# EAGLE design MultifyMainDriver (EAGLE 7.0.0)
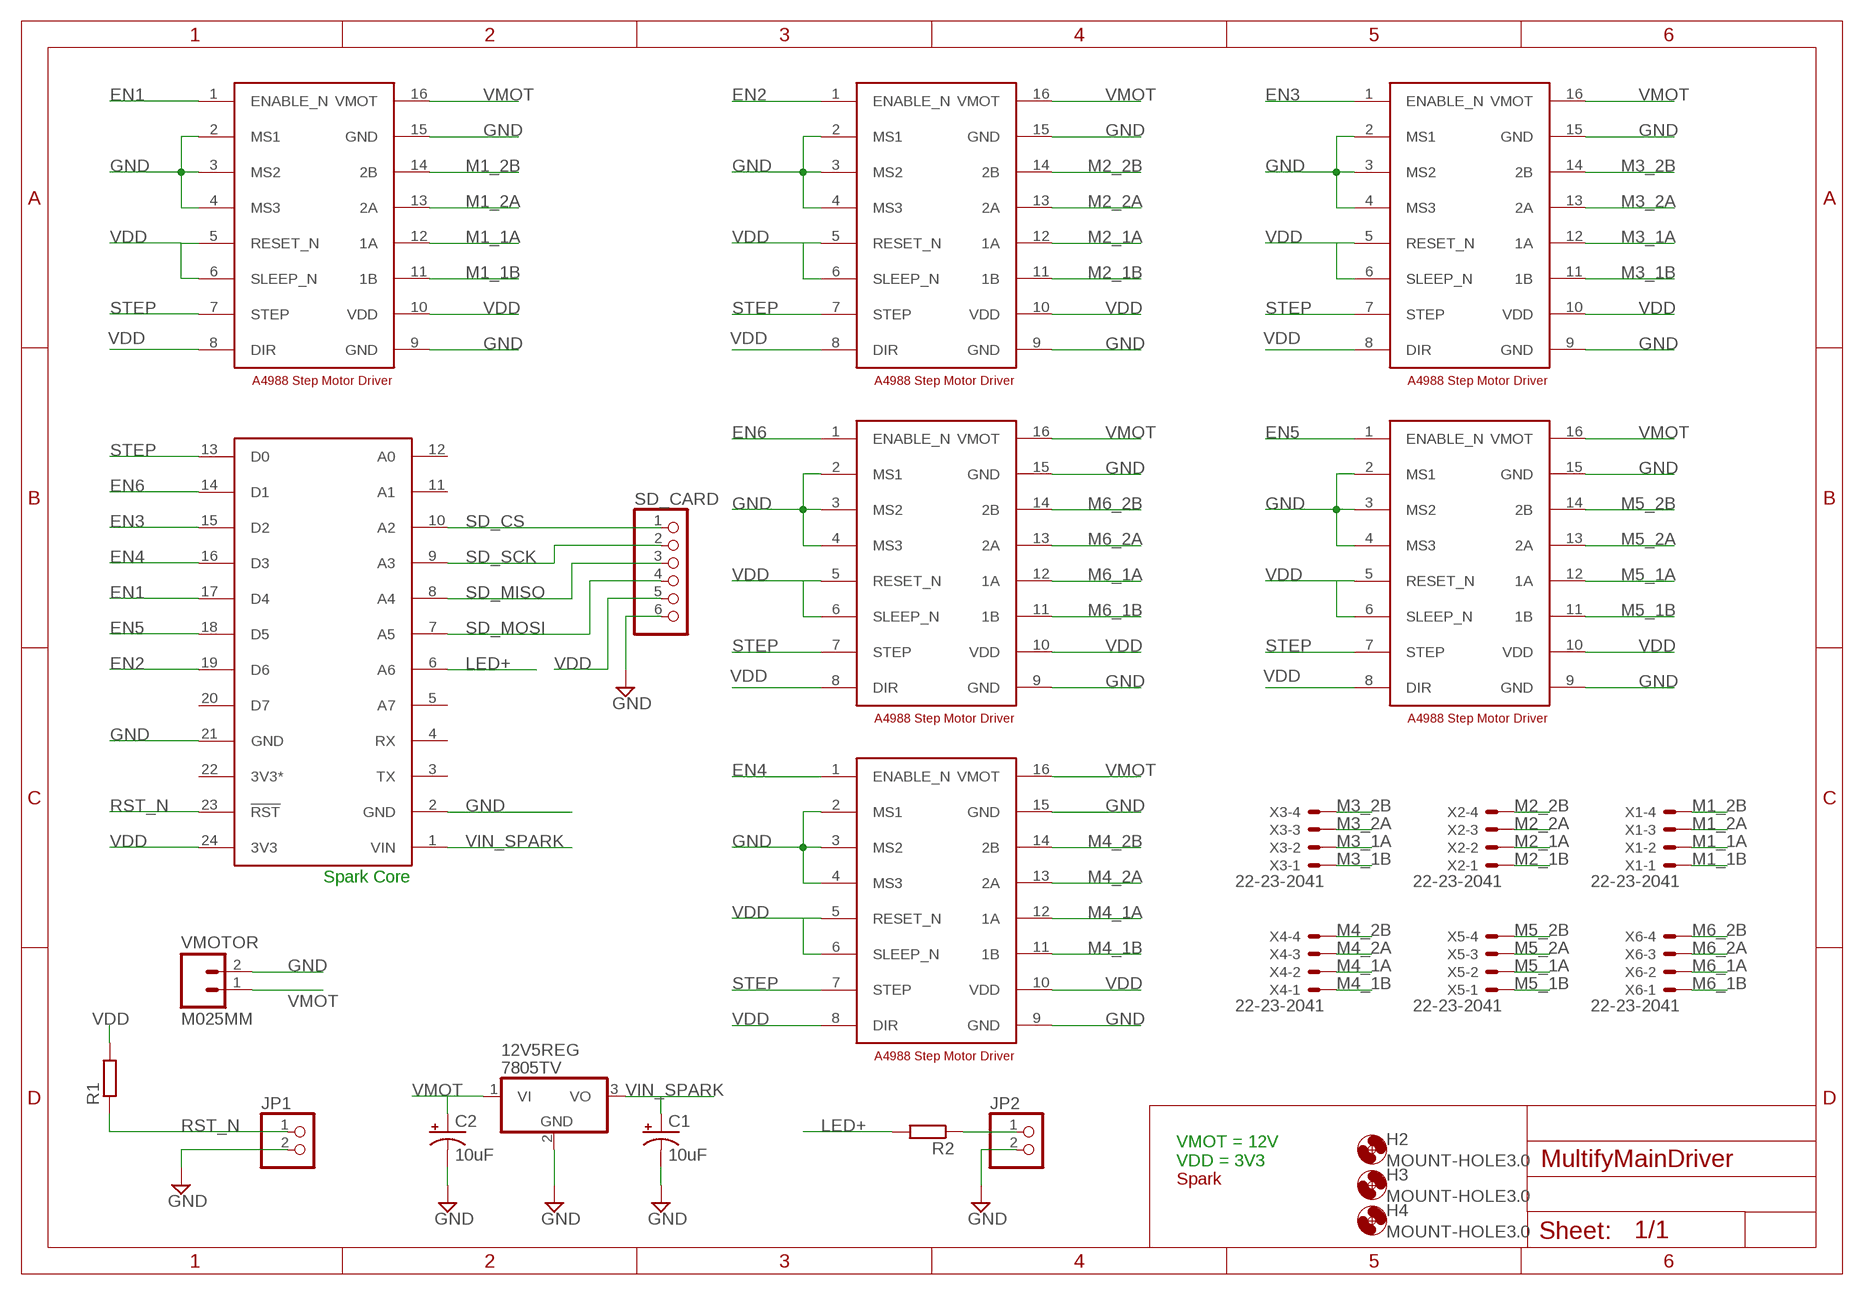
[diagram p0: schematic, sheet 1]

## Parts
12V5REG  7805TV  [TO220V]
C1  10uF  CPOL-USE3.5-8  [E3,5-8]
C2  10uF  CPOL-USE3.5-8  [E3,5-8]
DRIVER1  A4988_DEV  [A4988_PAC]
DRIVER2  A4988_DEV  [A4988_PAC]
DRIVER3  A4988_DEV  [A4988_PAC]
DRIVER4  A4988_DEV  [A4988_PAC]
DRIVER5  A4988_DEV  [A4988_PAC]
DRIVER6  A4988_DEV  [A4988_PAC]
H2  MOUNT-HOLE3.0  [3,0]
H3  MOUNT-HOLE3.0  [3,0]
H4  MOUNT-HOLE3.0  [3,0]
JP1  PINHD-1X2  [1X02]
JP2  PINHD-1X2  [1X02]
R1  R-EU_0207/7  [0207/7]
R2  R-EU_0207/7  [0207/7]
SD_CARD  PINHD-1X6  [1X06]
SPARK  SPARK_CORECORE  [SPARK_CORE]
U$2  SPARK_LOGO_WITH_PLANE  [SPARK_LOGO_PLUS_PLANE]
VMOTOR  M025MM  [SCREWTERMINAL-5MM-2]
X1  22-23-2041  [22-23-2041]
X2  22-23-2041  [22-23-2041]
X3  22-23-2041  [22-23-2041]
X4  22-23-2041  [22-23-2041]
X5  22-23-2041  [22-23-2041]
X6  22-23-2041  [22-23-2041]

## Nets
EN1: DRIVER1.1(ENABLE_N) SPARK.17(D4)
EN2: DRIVER2.1(ENABLE_N) SPARK.19(D6)
EN3: DRIVER3.1(ENABLE_N) SPARK.15(D2)
EN4: DRIVER4.1(ENABLE_N) SPARK.16(D3)
EN5: DRIVER6.1(ENABLE_N) SPARK.18(D5)
EN6: DRIVER5.1(ENABLE_N) SPARK.14(D1)
GND: 12V5REG.2(GND) C1.- C2.- DRIVER1.2(MS1) DRIVER1.3(MS2) DRIVER1.4(MS3) DRIVER1.9(GND) DRIVER1.15(GND) DRIVER2.2(MS1) DRIVER2.3(MS2) DRIVER2.4(MS3) DRIVER2.9(GND) DRIVER2.15(GND) DRIVER3.2(MS1) DRIVER3.3(MS2) DRIVER3.4(MS3) DRIVER3.9(GND) DRIVER3.15(GND) DRIVER4.2(MS1) DRIVER4.3(MS2) DRIVER4.4(MS3) DRIVER4.9(GND) DRIVER4.15(GND) DRIVER5.2(MS1) DRIVER5.3(MS2) DRIVER5.4(MS3) DRIVER5.9(GND) DRIVER5.15(GND) DRIVER6.2(MS1) DRIVER6.3(MS2) DRIVER6.4(MS3) DRIVER6.9(GND) DRIVER6.15(GND) JP1.2 JP2.2 SD_CARD.6 SPARK.2(GND) SPARK.21(GND) VMOTOR.2
LED+: R2.2 SPARK.6(A6)
M1_1A: DRIVER1.12(1A) X1.2
M1_1B: DRIVER1.11(1B) X1.1
M1_2A: DRIVER1.13(2A) X1.3
M1_2B: DRIVER1.14(2B) X1.4
M2_1A: DRIVER2.12(1A) X2.2
M2_1B: DRIVER2.11(1B) X2.1
M2_2A: DRIVER2.13(2A) X2.3
M2_2B: DRIVER2.14(2B) X2.4
M3_1A: DRIVER3.12(1A) X3.2
M3_1B: DRIVER3.11(1B) X3.1
M3_2A: DRIVER3.13(2A) X3.3
M3_2B: DRIVER3.14(2B) X3.4
M4_1A: DRIVER4.12(1A) X4.2
M4_1B: DRIVER4.11(1B) X4.1
M4_2A: DRIVER4.13(2A) X4.3
M4_2B: DRIVER4.14(2B) X4.4
M5_1A: DRIVER6.12(1A) X5.2
M5_1B: DRIVER6.11(1B) X5.1
M5_2A: DRIVER6.13(2A) X5.3
M5_2B: DRIVER6.14(2B) X5.4
M6_1A: DRIVER5.12(1A) X6.2
M6_1B: DRIVER5.11(1B) X6.1
M6_2A: DRIVER5.13(2A) X6.3
M6_2B: DRIVER5.14(2B) X6.4
N$1: JP2.1 R2.1
RST_N: JP1.1 R1.1 SPARK.23(!RST)
SD_CS: SD_CARD.1 SPARK.10(A2)
SD_MISO: SD_CARD.3 SPARK.8(A4)
SD_MOSI: SD_CARD.4 SPARK.7(A5)
SD_SCK: SD_CARD.2 SPARK.9(A3)
STEP: DRIVER1.7(STEP) DRIVER2.7(STEP) DRIVER3.7(STEP) DRIVER4.7(STEP) DRIVER5.7(STEP) DRIVER6.7(STEP) SPARK.13(D0)
VDD: DRIVER1.5(RESET_N) DRIVER1.6(SLEEP_N) DRIVER1.8(DIR) DRIVER1.10(VDD) DRIVER2.5(RESET_N) DRIVER2.6(SLEEP_N) DRIVER2.8(DIR) DRIVER2.10(VDD) DRIVER3.5(RESET_N) DRIVER3.6(SLEEP_N) DRIVER3.8(DIR) DRIVER3.10(VDD) DRIVER4.5(RESET_N) DRIVER4.6(SLEEP_N) DRIVER4.8(DIR) DRIVER4.10(VDD) DRIVER5.5(RESET_N) DRIVER5.6(SLEEP_N) DRIVER5.8(DIR) DRIVER5.10(VDD) DRIVER6.5(RESET_N) DRIVER6.6(SLEEP_N) DRIVER6.8(DIR) DRIVER6.10(VDD) R1.2 SD_CARD.5 SPARK.24(3V3)
VIN_SPARK: 12V5REG.3(VO) C1.+ SPARK.1(VIN)
VMOT: 12V5REG.1(VI) C2.+ DRIVER1.16(VMOT) DRIVER2.16(VMOT) DRIVER3.16(VMOT) DRIVER4.16(VMOT) DRIVER5.16(VMOT) DRIVER6.16(VMOT) VMOTOR.1
Unconnected: SPARK.3(TX) SPARK.4(RX) SPARK.5(A7) SPARK.11(A1) SPARK.12(A0) SPARK.20(D7)

## Notes on the sheet
- Spark Core
- VMOT = 12V
  VDD = 3V3

## Power pins joined to a net without a drawn wire
3V3*: SPARK.22(3V3*)

## Library data of the parts
12V5REG = linear:78*: Positive VOLTAGE REGULATOR Source: http://cache.national.com/ds/LM/LM78L05.pdf http://www.fairchildsemi.com/ds/LM/LM7805.pdf
C1 C2 = rcl:CPOL-US: POLARIZED CAPACITOR, American symbol
DRIVER1-DRIVER6 = A4988:A4988_DEV
H2-H4 = holes:MOUNT-HOLE: MOUNTING HOLE with drill center marker
JP1 JP2 = pinhead:PINHD-1X2: PIN HEADER
R1 R2 = rcl:R-EU_: RESISTOR, European symbol
SD_CARD = pinhead:PINHD-1X6: PIN HEADER
SPARK = Spark:SPARK_CORE
U$2 = Spark:SPARK_LOGO_WITH_PLANE
VMOTOR = SparkFun-Connectors:M02: Standard 2-pin 0.1" header. Use with - straight break away headers ( PRT-00116) - right angle break away headers (PRT-00553) - swiss pins (PRT-00743) - machine pins (PRT-00117) - female headers (PRT-00115) Molex polarized connector foot print use with: PRT-08233 with associated crimp pins and housings. 2.54_SCREWTERM for use with PRT-10571. 3.5mm Screw Terminal footprints for PRT-08084 5mm Screw Terminal footprints for use with PRT-08432; STOREFRONT_ID: PRT-08432
X1-X6 = con-molex:22-23-2041: .100" (2.54mm) Center Header - 4 Pin; MF: MOLEX; MPN: 22-23-2041; OC_FARNELL: 1462920; OC_NEWARK: 38C0355

## Board
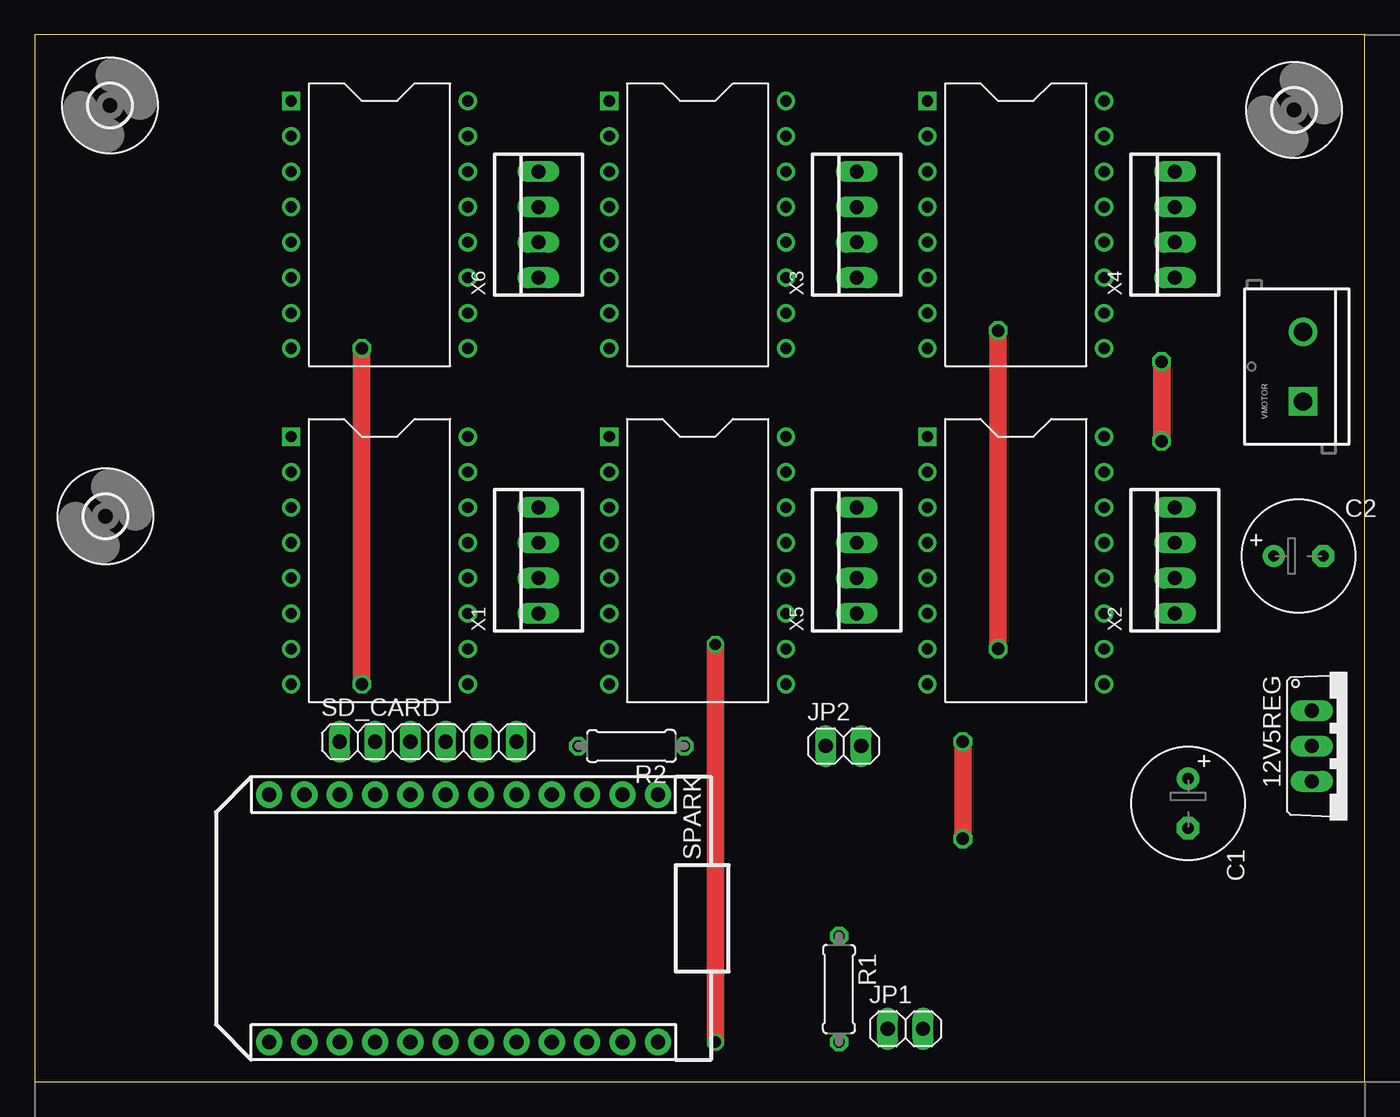
[diagram p1: board, top side]
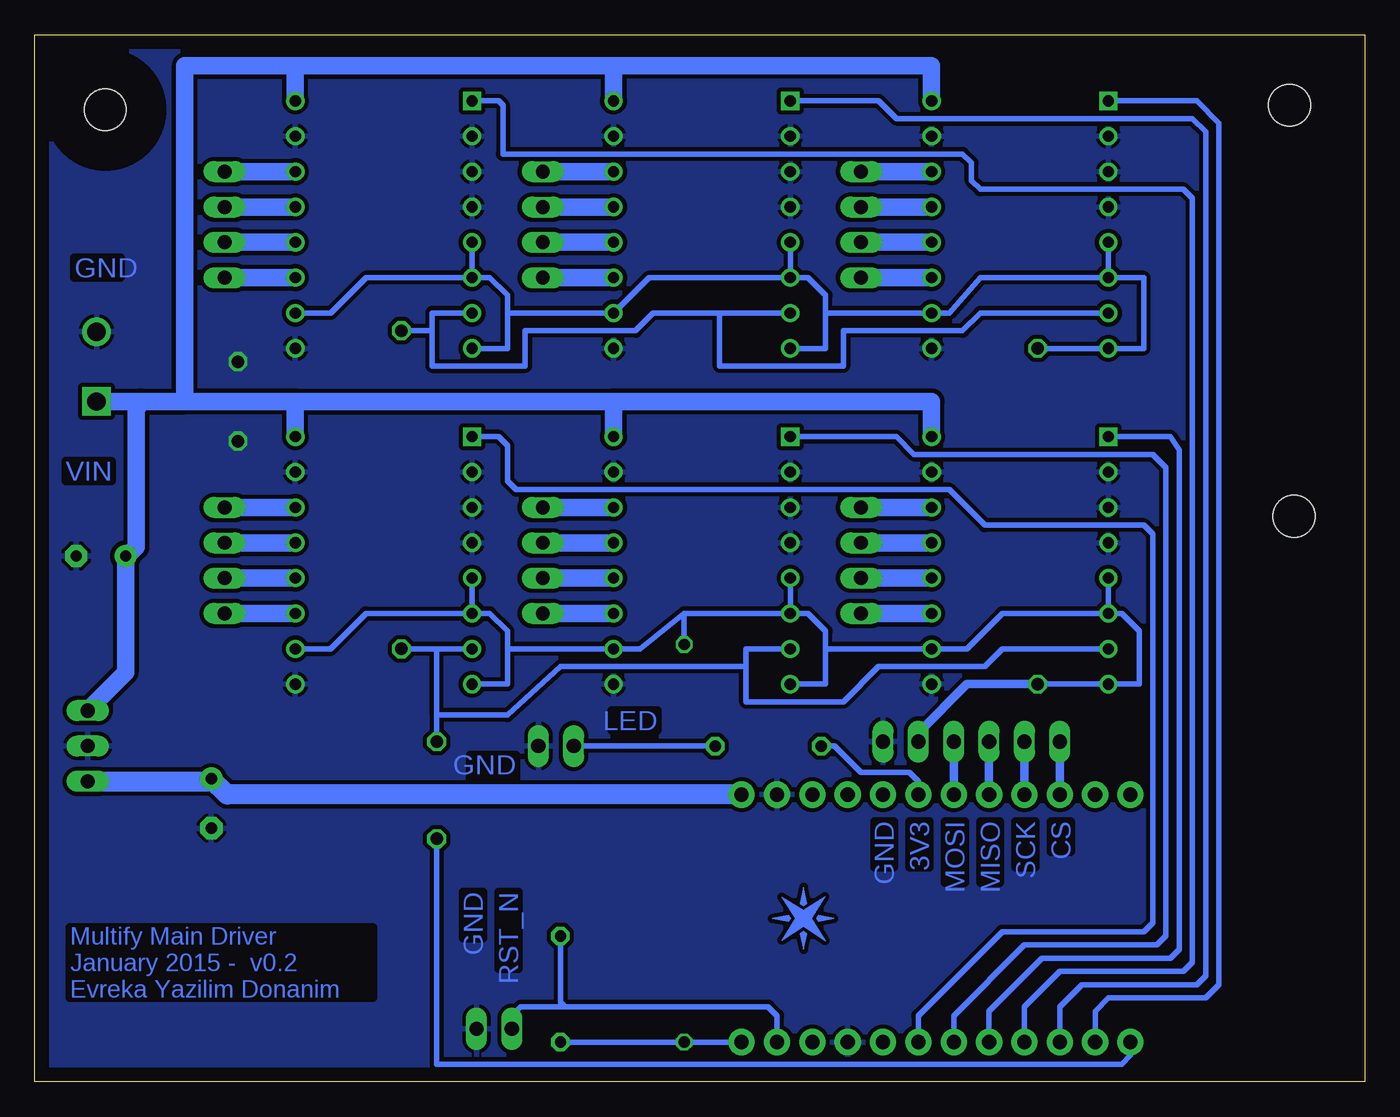
[diagram p2: board, bottom side, seen from below]

Size 95.56 x 75.24 mm. Coordinates in mm from the lower left corner, seen from the top.
Outline: 0,0 95.56,0 95.56,75.24 0,75.24 0,0
Copper layers (1*16): Top 0.035mm / dielectric 1.5mm / Bottom 0.035mm
Design rules "default": minimum track width 10mil, minimum drill 24mil, track to track 8mil, track to pad 8mil, pad to pad 8mil, via to via 8mil, smd to smd 8mil, copper to edge 40mil, drill to drill 8mil, minimum pad ring 10mil, minimum via ring 8mil, stop-mask expansion 4mil, vias tented up to drill 0mil, thermal gap 10mil

### Footprints (pad centres in the part's own frame; a part is rotated, then mirrored left to right if it is on the bottom)
TO220V = drill 1.016 long: 1 -2.54,-2.54; 2 0,-2.54; 3 2.54,-2.54
E3,5-8 = drill 0.813 pad 1.6: + -1.778,0 | drill 0.813 pad 1.6 octagon: - 1.778,0
A4988_PAC = drill 0.8 square: 1 -6.35,8.89 | drill 0.8: 2 -6.35,6.35; 3 -6.35,3.81; 4 -6.35,1.27; 5 -6.35,-1.27; 6 -6.35,-3.81; 7 -6.35,-6.35; 8 -6.35,-8.89; 9 6.35,-8.89; 10 6.35,-6.35; 11 6.35,-3.81; 12 6.35,-1.27; 13 6.35,1.27; 14 6.35,3.81; 15 6.35,6.35; 16 6.35,8.89
3,0 = hole 3: 0,0
1X02 = drill 1.016 long: 1 -1.27,0; 2 1.27,0
0207/7 = drill 0.813 octagon: 1 -3.81,0; 2 3.81,0
1X06 = drill 1.016 long: 1 -6.35,0; 2 -3.81,0; 3 -1.27,0; 4 1.27,0; 5 3.81,0; 6 6.35,0
SPARK_CORE = drill 1.016 pad 1.88: 1 -8.89,13.97; 2 -8.89,11.43; 3 -8.89,8.89; 4 -8.89,6.35; 5 -8.89,3.81; 6 -8.89,1.27; 7 -8.89,-1.27; 8 -8.89,-3.81; 9 -8.89,-6.35; 10 -8.89,-8.89; 11 -8.89,-11.43; 12 -8.89,-13.97; 13 8.89,-13.97; 14 8.89,-11.43; 15 8.89,-8.89; 16 8.89,-6.35; 17 8.89,-3.81; 18 8.89,-1.27; 19 8.89,1.27; 20 8.89,3.81; 21 8.89,6.35; 22 8.89,8.89; 23 8.89,11.43; 24 8.89,13.97
SCREWTERMINAL-5MM-2 = drill 1.3 pad 2.032 square: 1 0,0 | drill 1.3 pad 2.032: 2 5,0
22-23-2041 = drill 1 long: 1 -3.81,0; 2 -1.27,0; 3 1.27,0; 4 3.81,0

### Placement (x,y rotation side)
12V5REG  94.3,24.13 270 top
C1  82.87,20 270 top
C2  90.81,37.78 0 top
DRIVER1  24.77,37.47 0 top
DRIVER2  70.48,37.47 0 top
DRIVER3  47.62,61.59 0 top
DRIVER4  70.48,61.59 0 top
DRIVER5  24.77,61.59 0 top
DRIVER6  47.62,37.47 0 top
H2  90.49,69.85 0 top
H3  5.08,40.64 0 top
H4  5.4,70.17 0 top
JP1  62.55,3.81 0 top
JP2  58.1,24.13 0 top
R1  57.78,6.67 270 top
R2  42.86,24.13 180 top
SD_CARD  28.26,24.45 0 top
SPARK  30.8,11.75 270 top
U$2  40.32,11.75 0 bottom
VMOTOR  91.12,48.9 90 top
X1  36.2,37.47 90 top
X2  81.92,37.47 90 top
X3  59.05,61.59 90 top
X4  81.92,61.59 90 top
X5  59.05,37.47 90 top
X6  36.2,61.59 90 top

### Tracks (layer width: path | path; a pad name or v marks a point on that pad's centre or on a via)
EN1
  Bottom 0.406: DRIVER1.1 13.97,46.35 13.34,45.4 13.34,9.53 13.97,8.89 23.18,8.89 26.99,5.08 SPARK.17
EN2
  Bottom 0.406: SPARK.19 32.07,4.76 26.04,10.79 15.88,10.79 15.24,11.43 15.24,39.37 15.88,40.01 27.3,40.01 29.84,42.55 60.96,42.55 61.59,43.18 61.59,45.72 62.23,46.35 DRIVER2.1
EN3
  Bottom 0.406: DRIVER3.1 34.92,70.48 33.66,69.22 12.38,69.22 11.43,68.26 11.43,7.62 12.06,6.99 20.32,6.99 21.91,5.4 SPARK.15
EN4
  Bottom 0.406: DRIVER4.1 62.23,70.48 61.91,70.17 61.91,66.67 28.89,66.67 28.26,66.04 28.26,64.77 27.62,64.14 13.02,64.14 12.38,63.5 12.38,8.57 13.02,7.94 21.91,7.94 24.45,5.4 SPARK.16
EN5
  Bottom 0.406: DRIVER6.1 33.66,46.35 32.38,45.09 15.24,45.09 14.29,44.13 14.29,10.48 14.92,9.84 24.45,9.84 29.53,4.76 SPARK.18
EN6
  Bottom 0.406: 14.61,70.48 DRIVER5.1 12.06,70.48 10.48,68.9 10.48,6.99 11.43,6.03 18.41,6.03 19.37,5.08 SPARK.14
GND  (via drill 0.9)
  Top 1.27: v80.96,51.75 v80.96,46.04
  pour Bottom (isolate 0.305): 0.32,75.25 95.57,75.25 95.57,0 0.32,0
LED+
  Bottom 0.406: SPARK.6 32.07,21.59 32.7,22.23 36.2,22.23 38.1,24.13 R2.2
M1_1A
  Bottom 1.27: X1.2 DRIVER1.12
M1_1B
  Bottom 1.27: X1.1 DRIVER1.11
M1_2A
  Bottom 1.27: X1.3 DRIVER1.13
M1_2B
  Bottom 1.27: DRIVER1.14 X1.4
M2_1A
  Bottom 1.27: X2.2 DRIVER2.12
M2_1B
  Bottom 1.27: X2.1 DRIVER2.11
M2_2A
  Bottom 1.27: X2.3 DRIVER2.13
M2_2B
  Bottom 1.27: X2.4 DRIVER2.14
M3_1A
  Bottom 1.27: X3.2 DRIVER3.12
M3_1B
  Bottom 1.27: X3.1 DRIVER3.11
M3_2A
  Bottom 1.27: X3.3 DRIVER3.13
M3_2B
  Bottom 1.27: X3.4 DRIVER3.14
M4_1A
  Bottom 1.27: X4.2 DRIVER4.12
M4_1B
  Bottom 1.27: X4.1 DRIVER4.11
M4_2A
  Bottom 1.27: X4.3 DRIVER4.13
M4_2B
  Bottom 1.27: X4.4 DRIVER4.14
M5_1A
  Bottom 1.27: X5.2 DRIVER6.12
M5_1B
  Bottom 1.27: X5.1 DRIVER6.11
M5_2A
  Bottom 1.27: X5.3 DRIVER6.13
M5_2B
  Bottom 1.27: X5.4 DRIVER6.14
M6_1A
  Bottom 1.27: DRIVER5.12 X6.2
M6_1B
  Bottom 1.27: DRIVER5.11 X6.1
M6_2A
  Bottom 1.27: DRIVER5.13 X6.3
M6_2B
  Bottom 1.27: DRIVER5.14 X6.4
N$1
  Bottom 0.406: R2.1 JP2.1
RST_N
  Bottom 0.406: SPARK.23 42.23,4.76 42.86,5.4 57.47,5.4 | 57.47,5.4 60.64,5.4 61.28,4.76 JP1.1 | R1.1 57.78,5.71 57.47,5.4
SD_CS
  Bottom 0.61: SD_CARD.1 SPARK.10
SD_MISO
  Bottom 0.61: SD_CARD.3 SPARK.8
SD_MOSI
  Bottom 0.61: SD_CARD.4 SPARK.7
SD_SCK
  Bottom 0.61: SD_CARD.2 SPARK.9
STEP  (via drill 0.9)
  Top 1.27: v69.22,31.11 v69.22,53.98 | v66.67,24.45 v66.67,17.46
  Bottom 0.406: DRIVER6.7 44.45,31.11 44.45,29.84 | DRIVER5.7 27.62,55.24 28.89,53.98 37.47,53.98 37.47,51.44 46.35,51.44 46.35,55.24 | DRIVER3.7 46.35,55.24 | 46.35,55.24 51.12,55.24 52.39,53.98 60.33,53.98 60.33,51.44 66.99,51.44 66.99,53.98 | DRIVER4.7 66.99,55.24 66.99,53.98 | DRIVER1.7 26.04,31.11 27.3,29.84 34.92,29.84 37.47,27.3 44.45,27.3 44.45,29.84 | 44.45,29.84 57.78,29.84 61.59,26.35 66.67,26.35 | 66.67,26.35 66.67,31.11 | DRIVER2.7 66.67,31.11 | 66.67,31.11 v69.22,31.11 | v69.22,53.98 66.99,53.98 | SPARK.13 16.83,1.91 17.46,1.27 66.67,1.27 v66.67,17.46 | 66.67,26.35 v66.67,24.45
VDD  (via drill 0.8, 0.9)
  Top 1.27: v23.5,28.57 v23.5,52.7 | v48.9,2.86 v48.9,31.43
  Bottom 0.406: DRIVER5.5 DRIVER5.6 | DRIVER3.5 DRIVER3.6 | DRIVER4.5 DRIVER4.6 | DRIVER1.5 DRIVER1.6 | DRIVER6.5 DRIVER6.6 | DRIVER2.6 DRIVER2.5 | DRIVER2.10 74.3,31.11 71.75,33.66 DRIVER2.6 | DRIVER5.6 27.62,57.78 29.84,55.24 DRIVER5.10 38.73,55.24 | DRIVER3.6 51.44,57.78 DRIVER3.10 61.59,55.24 | DRIVER4.6 71.75,57.78 74.3,55.24 DRIVER4.10 | DRIVER6.6 48.9,33.66 | 48.9,33.66 52.07,31.11 DRIVER6.10 61.59,31.11 | DRIVER1.6 26.04,33.66 28.57,31.11 DRIVER1.10 38.73,31.11 | DRIVER5.6 15.88,57.78 15.88,52.7 DRIVER5.8 v23.5,52.7 | DRIVER3.8 38.73,52.7 38.73,55.24 | 38.73,55.24 38.73,56.52 40.01,57.78 DRIVER3.6 | DRIVER4.8 61.59,52.7 61.59,55.24 | 61.59,55.24 61.59,56.52 62.87,57.78 DRIVER4.6 | DRIVER1.6 17.46,33.66 16.19,32.38 16.19,28.57 DRIVER1.8 v23.5,28.57 | DRIVER6.8 38.73,28.57 38.73,31.11 | 38.73,31.11 38.73,32.38 40.01,33.66 DRIVER6.6 | DRIVER2.8 61.59,28.57 61.59,31.11 | 61.59,31.11 61.59,32.38 62.87,33.66 DRIVER2.6 | v48.9,31.43 48.9,33.66 | SPARK.24 v48.9,2.86 R1.2
  Bottom 0.61: SD_CARD.5 32.07,25.08 28.57,28.57 v23.5,28.57
VIN_SPARK
  Bottom 1.422: SPARK.1 81.72,20.64 C1.+ 83.06,21.59 12V5REG.3
VMOT
  Bottom 1.27: DRIVER5.16 31.11,73.03 53.98,73.03 | 53.98,73.03 DRIVER3.16 | DRIVER4.16 76.83,73.03 | 76.83,73.03 53.98,73.03 | DRIVER1.16 31.11,48.9 53.98,48.9 | 53.98,48.9 DRIVER6.16 | DRIVER2.16 76.83,48.9 | 76.83,48.9 53.98,48.9 | 76.83,48.9 84.77,48.9 | 84.77,48.9 84.77,73.03 76.83,73.03 | VMOTOR.1 87.95,48.9 | 87.95,48.9 84.77,48.9 | 87.95,48.9 88.27,48.26 88.27,38.42 88.9,37.78 C2.+ 89.03,29.4 12V5REG.1

### Text on the board
Bottom: GND | VIN | LED | GND | CS | SCK | MISO | MOSI | 3V3 | GND | RST_N | GND | Multify Main Driver / January 2015 - v0.2 / Evreka Yazilim Donanim